# Altium schematic sheet AUDIO.SchDoc
size A4
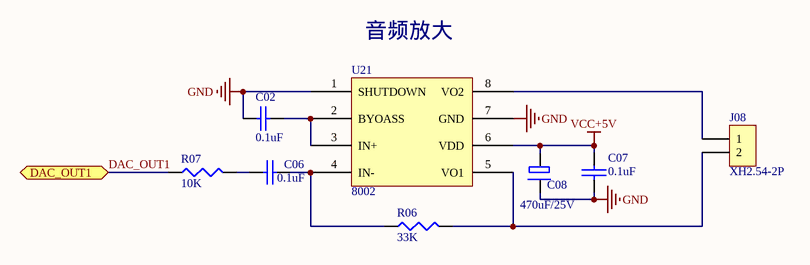
[diagram p0: AUDIO.SchDoc]

## Parts
C02  0.1uF  [0603]
C06  0.1uF  [0603]
C07  0.1uF  [0603]
C08  470uF/25V  [RB3.5-W]
J08  XH2.54-2P  [2.54]
R06  33K  [0603]
R07  10K  [0603]
U21  8002  [SO-8]

## Ports
DAC_OUT1

## Nets
GND: C02.2 C07.1 C08.2 U21.1(SHUTDOWN) U21.7(GND)
VCC+5V: C07.2 C08.1 U21.6(VDD)
DAC_OUT1: R07.1 ; port DAC_OUT1
NetC02_1: C02.1 U21.2(BYOASS) U21.3(IN+)
NetC06_1: C06.1 R06.1 U21.4(IN-)
NetC06_2: C06.2 R07.2
NetJ08_1: J08.1 U21.8(VO2)
NetJ08_2: J08.2 R06.2 U21.5(VO1)

## Notes on the sheet
- (near U21) 音频放大

## Library data of the parts
C02 C06 C07 = CAP-0603: 0603陶瓷贴片电容
C08 = 470uF/25V: 470uF/25V电解电容
J08 = XH2.54-2P: XH2.54-2A
R06 R07 = RES-0603: 陶瓷贴片电阻0603封装
U21 = 8002: 音频功放IC